# Altium schematic sheet XoomFloppy Pro.SchDoc: XoomFloppy Pro
size 420 x 297 mm; Author: DiWou; CompanyName: DL2DW; DrawnBy: DiWou; Organization: DL2DW; DocumentNumber: 1; Revision: 1.0; SheetNumber: 1; SheetTotal: 1; DrawnDate: 18.11.2019; Title1: XoomFloppy Pro; Title2: .; Title3: .; Desc1: Version 1.0; Desc2: .
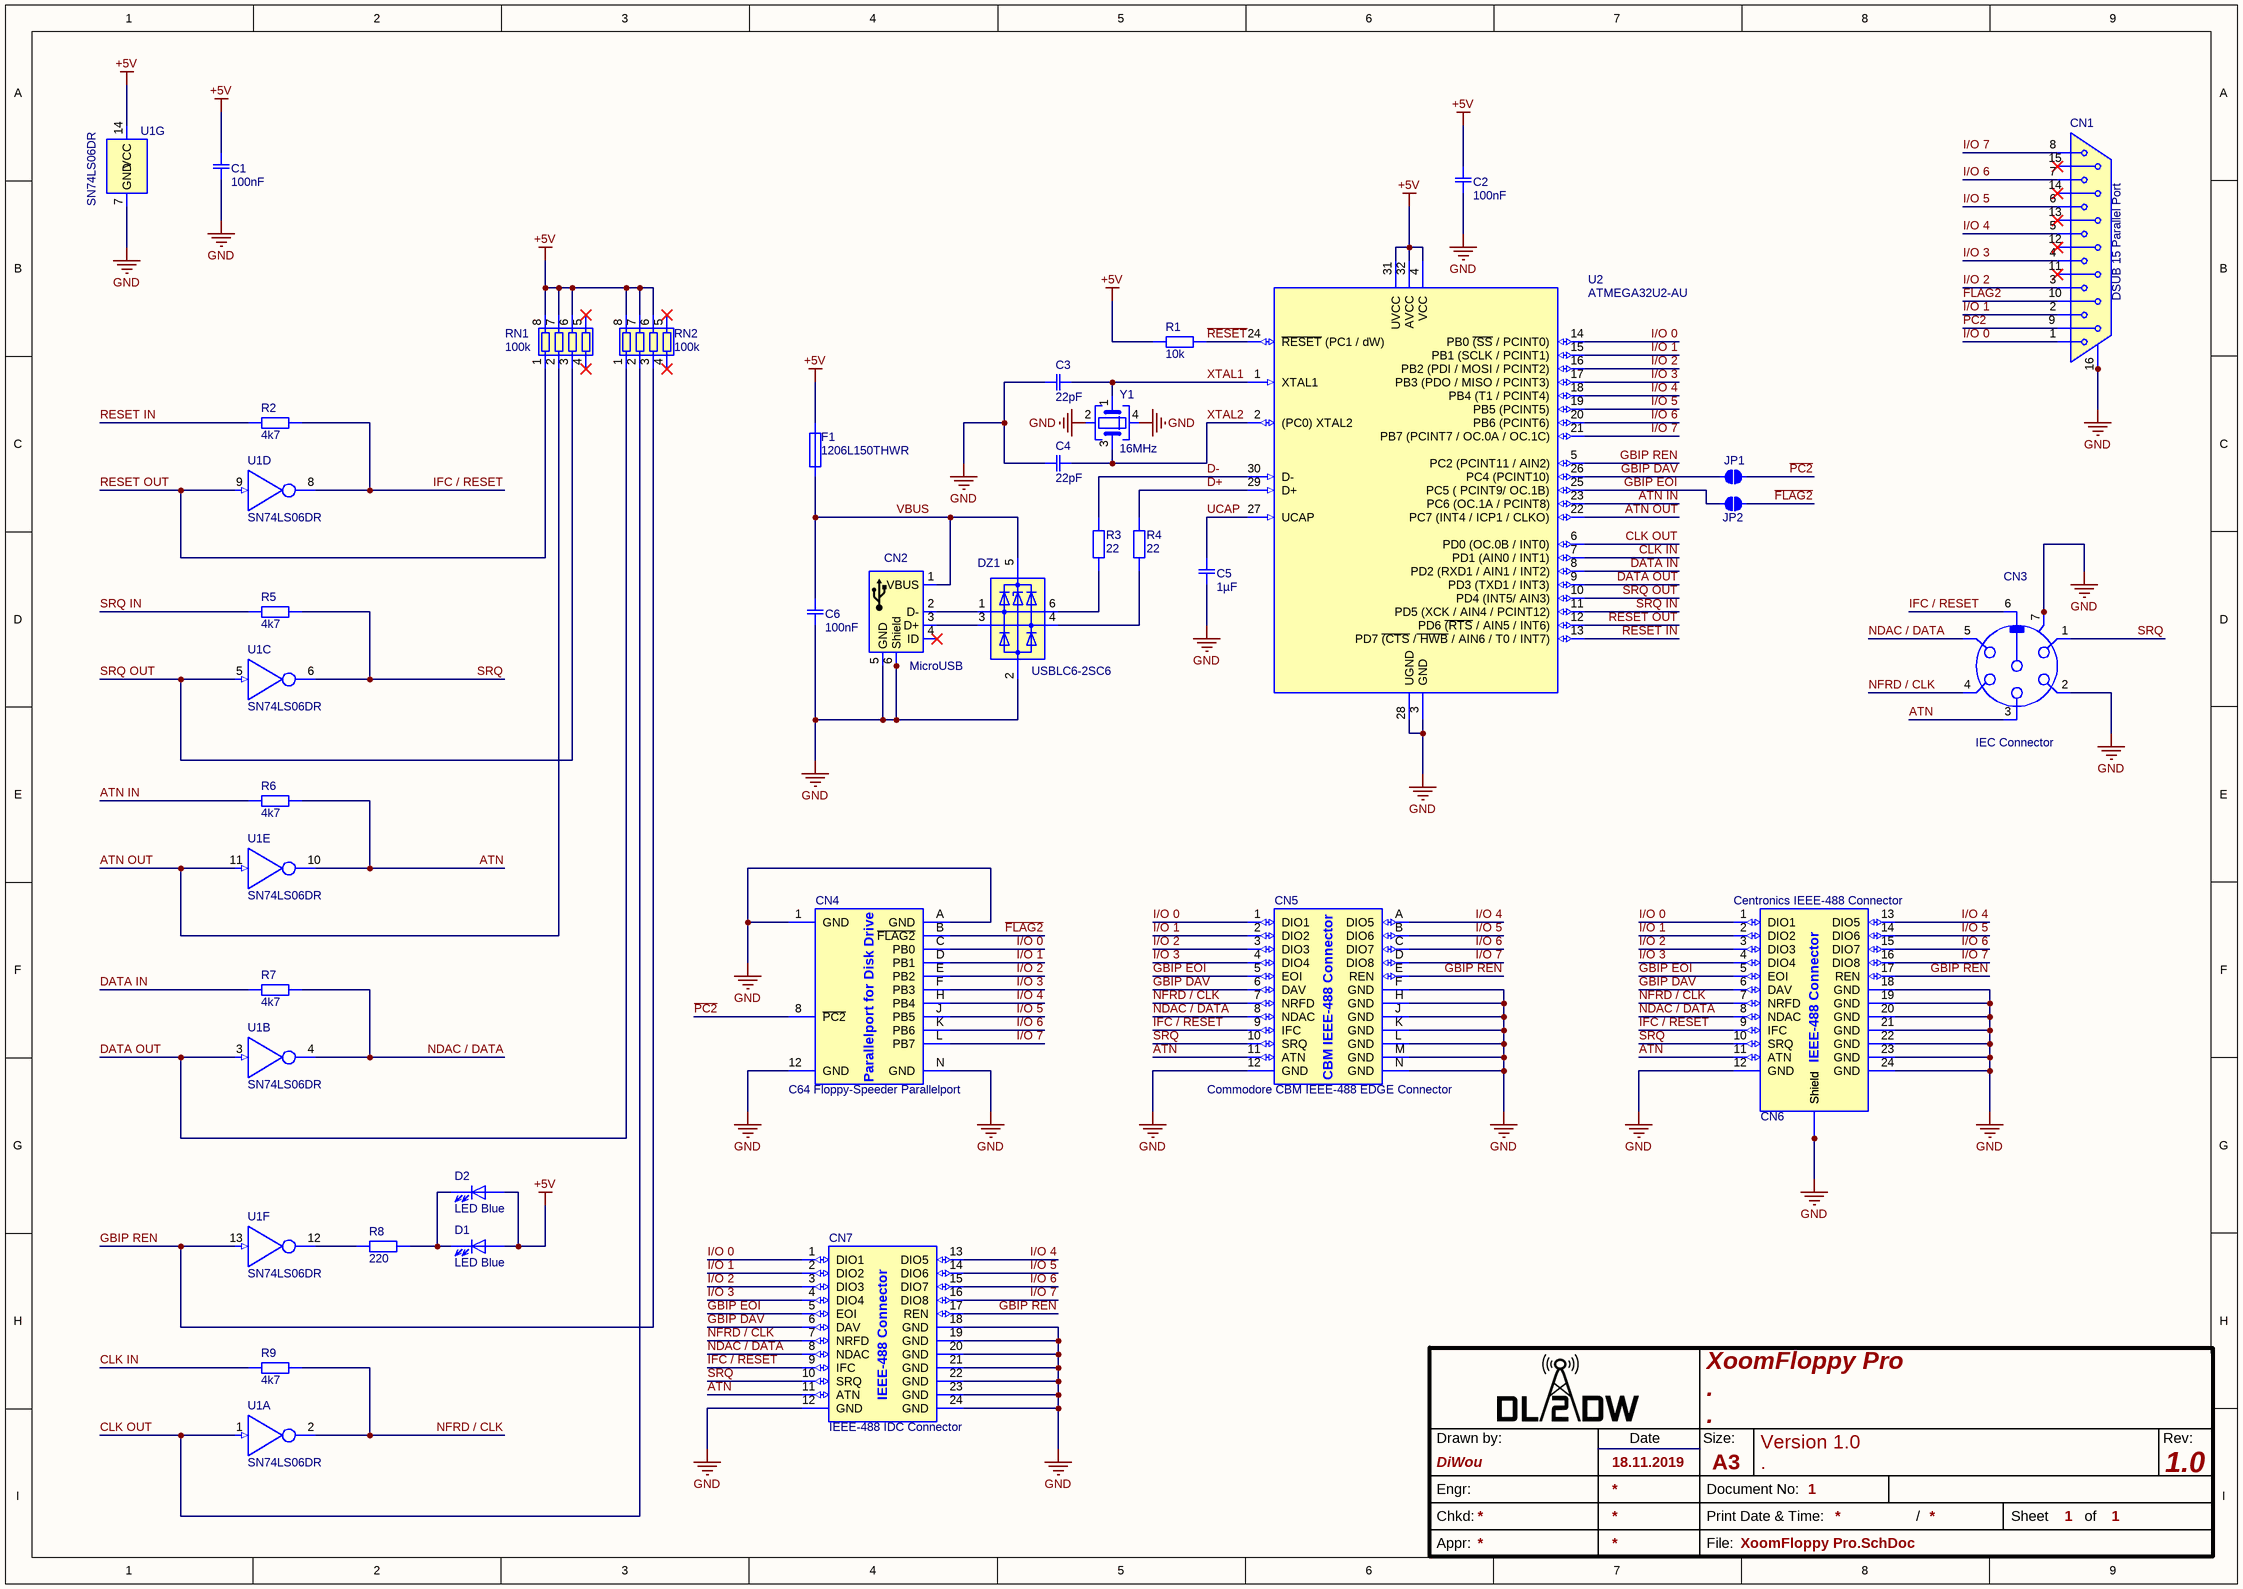
[diagram p0: XoomFloppy Pro.SchDoc]

## Parts
C1  100nF  [CAP 100nF SMD 0603 C0603C104J3RACTU]
C2  100nF  [CAP 100nF SMD 0603 C0603C104J3RACTU]
C3  22pF  [CAP 22pF SMD 0603 C0603C220J5RAC7867]
C4  22pF  [CAP 22pF SMD 0603 C0603C220J5RAC7867]
C5  1µF  [CAP 1µF SMD 0603 C0603C105K3RACTU]
C6  100nF  [CAP 100nF SMD 0603 C0603C104J3RACTU]
CN1  DSUB 15 Parallel Port  [D-SUB 15 Male Connector Right Angle 8.1mm]
CN2  MicroUSB  [MicroUSB Connector Right Angle Receptacle (Würth 629105150521)]
CN3  IEC Connector  [DIN 45322 Circular Connector (DIN-6)]
CN4  C64 Floppy-Speeder Parallelport  [C64 User Port]
CN5  Commodore CBM IEEE-488 EDGE Connector  [CBM IEEE-488 EDGE Connector]
CN6  Centronics IEEE-488 Connector  [GPIB Centronics Female 2x12pos. Connector]
CN7  IEEE-488 IDC Connector  [IEEE-488 IDC Header 2x12 P2.54mm Straight]
D1  LED Blue  [LED Blue SMD 0603]
D2  LED Blue  [LED 3mm Blue Straight]
DZ1  USBLC6-2SC6  [USBLC6-2SC6]
F1  1206L150THWR  [Littelfuse 1206L150THWR]
JP1  Solder Jumper Open  [Solder Jumper Open Variant 2]  (value not drawn)
JP2  Solder Jumper Open  [Solder Jumper Open Variant 2]  (value not drawn)
R1  10k  [10k Ohm R 0603 SMD]
R2  4k7  [4,7k Ohm R 0603 SMD]
R3  22  [22 Ohm R 0603 SMD]
R4  22  [22 Ohm R 0603 SMD]
R5  4k7  [4,7k Ohm R 0603 SMD]
R6  4k7  [4,7k Ohm R 0603 SMD]
R7  4k7  [4,7k Ohm R 0603 SMD]
R8  220  [220 Ohm R 0603 SMD]
R9  4k7  [4,7k Ohm R 0603 SMD]
RN1  100k  [RES ARRAY 4 RES 100K OHM 0804]
RN2  100k  [RES ARRAY 4 RES 100K OHM 0804]
U1  SN74LS06DR  [SN74LS06DR SOIC-14 P1.27mm W3.9mm]  (parts A,B,C,D,E,F,G of 7)
U2  ATMEGA32U2-AU  [TQFP-32 P0.8mm 7x7mm ATMega32u2]
Y1  16MHz  [Crystal 16MHz SMD 2.0x1.6mm 4pos GND2-4]

## Nets
+5V: C1.2 C2.2 D1.2 D2.2 F1.2 R1.1 RN1.6 RN1.7 RN1.8 RN2.6 RN2.7 RN2.8 U1.14(VCC) U2.4(VCC) U2.31(UVCC) U2.32(AVCC)
GND: C1.1 C2.1 C3.1 C4.1 C5.1 C6.1 CN1.16 CN1.17 CN2.5(GND) CN2.6(Shield) CN2.7(Shield) CN2.8(Shield) CN2.9(Shield) CN3.2 CN3.7 CN3.8 CN4.1(GND) CN4.12(GND) CN4.A(GND) CN4.N(GND) CN5.12(GND) CN5.F(GND) CN5.H(GND) CN5.J(GND) CN5.K(GND) CN5.L(GND) CN5.M(GND) CN5.N(GND) CN6.12(GND) CN6.18(GND) CN6.19(GND) CN6.20(GND) CN6.21(GND) CN6.22(GND) CN6.23(GND) CN6.24(GND) CN6.Shield1(Shield) CN6.Shield2(Shield) CN7.12(GND) CN7.18(GND) CN7.19(GND) CN7.20(GND) CN7.21(GND) CN7.22(GND) CN7.23(GND) CN7.24(GND) DZ1.2 U1.7(GND) U2.3(GND) U2.28(UGND) Y1.2 Y1.4
~{FLAG2}: CN1.10 CN4.B(~{FLAG2}) JP2.2
~{PC2}: CN1.9 CN4.8(~{PC2}) JP1.2
~{RESET}: R1.2 U2.24(~{RESET}_(PC1_/_dW))
ATN: CN3.3 CN5.11(ATN) CN6.11(ATN) CN7.11(ATN) R6.2 U1.10(5Y)
ATN IN: R6.1 U2.23(PC6_(OC.1A_/_PCINT8))
ATN OUT: RN1.2 U1.11(5A) U2.22(PC7_(INT4_/_ICP1_/_CLKO))
CLK IN: R9.1 U2.7(PD1_(AIN0_/_INT1))
CLK OUT: RN2.2 U1.1(1A) U2.6(PD0_(OC.0B_/_INT0))
D+: R4.2 U2.29(D+)
D-: R3.2 U2.30(D-)
DATA IN: R7.1 U2.8(PD2_(RXD1_/_AIN1_/_INT2))
DATA OUT: RN2.1 U1.3(2A) U2.9(PD3_(TXD1_/_INT3))
GBIP DAV: CN5.6(DAV) CN6.6(DAV) CN7.6(DAV) JP1.1 U2.26(PC4_(PCINT10))
GBIP EOI: CN5.5(EOI) CN6.5(EOI) CN7.5(EOI) JP2.1 U2.25(PC5_(_PCINT9/_OC.1B))
GBIP REN: CN5.E(REN) CN6.17(REN) CN7.17(REN) RN2.3 U1.13(6A) U2.5(PC2_(PCINT11_/_AIN2))
I/O 0: CN1.1 CN4.C(PB0) CN5.1(DIO1) CN6.1(DIO1) CN7.1(DIO1) U2.14(PB0_~{(SS}_/_PCINT0))
I/O 1: CN1.2 CN4.D(PB1) CN5.2(DIO2) CN6.2(DIO2) CN7.2(DIO2) U2.15(PB1_(SCLK_/_PCINT1))
I/O 2: CN1.3 CN4.E(PB2) CN5.3(DIO3) CN6.3(DIO3) CN7.3(DIO3) U2.16(PB2_(PDI_/_MOSI_/_PCINT2))
I/O 3: CN1.4 CN4.F(PB3) CN5.4(DIO4) CN6.4(DIO4) CN7.4(DIO4) U2.17(PB3_(PDO_/_MISO_/_PCINT3))
I/O 4: CN1.5 CN4.H(PB4) CN5.A(DIO5) CN6.13(DIO5) CN7.13(DIO5) U2.18(PB4_(T1_/_PCINT4))
I/O 5: CN1.6 CN4.J(PB5) CN5.B(DIO6) CN6.14(DIO6) CN7.14(DIO6) U2.19(PB5_(PCINT5))
I/O 6: CN1.7 CN4.K(PB6) CN5.C(DIO7) CN6.15(DIO7) CN7.15(DIO7) U2.20(PB6_(PCINT6))
I/O 7: CN1.8 CN4.L(PB7) CN5.D(DIO8) CN6.16(DIO8) CN7.16(DIO8) U2.21(PB7_(PCINT7_/_OC.0A_/_OC.1C))
IFC / RESET: CN3.6 CN5.9(IFC) CN6.9(IFC) CN7.9(IFC) R2.2 U1.8(4Y)
NDAC / DATA: CN3.5 CN5.8(NDAC) CN6.8(NDAC) CN7.8(NDAC) R7.2 U1.4(2Y)
NFRD / CLK: CN3.4 CN5.7(NRFD) CN6.7(NRFD) CN7.7(NRFD) R9.2 U1.2(1Y)
RESET IN: R2.1 U2.13(PD7_~{(CTS}_/~{_HWB}_/_AIN6_/_T0_/_INT7))
RESET OUT: RN1.1 U1.9(4A) U2.12(PD6_~{(RTS}_/_AIN5_/_INT6))
SRQ: CN3.1 CN5.10(SRQ) CN6.10(SRQ) CN7.10(SRQ) R5.2 U1.6(3Y)
SRQ IN: R5.1 U2.11(PD5_(XCK_/_AIN4_/_PCINT12))
SRQ OUT: RN1.3 U1.5(3A) U2.10(PD4_(INT5/_AIN3))
UCAP: C5.2 U2.27(UCAP)
VBUS: C6.2 CN2.1(VBUS) DZ1.5 F1.1
XTAL1: C3.2 U2.1(XTAL1) Y1.1
XTAL2: C4.2 U2.2((PC0)_XTAL2) Y1.3
NetCN2_2: CN2.2(D-) DZ1.1
NetCN2_3: CN2.3(D+) DZ1.3
NetD1_1: D1.1 D2.1 R8.2
NetDZ1_4: DZ1.4 R4.1
NetDZ1_6: DZ1.6 R3.1
NetR8_1: R8.1 U1.12(6Y)

Not connected (* = marked no-connect by the designer): CN1 11* 12* 13* 14* 15*; CN2 4(ID)* 10(Mounting_Hole) 11(Mounting_Hole); CN4 2(N/C) 3(N/C) 4(N/C) 5(N/C) 6(N/C) 7(N/C) 9(N/C) 10(N/C) 11(N/C) M(N/C); CN6 H1(Hole) H2(Hole); RN1 4* 5*; RN2 4* 5*

## Notes on the sheet
- Drawn by:
- Date
- Size:
- A3
- Rev:
- Engr:
- Chkd:
- Appr:
- File:
- Document No:
- Print Date & Time:
- /
- Sheet
- of
- (in symbol CMP-Commodore-00003-4) CBM IEEE-488 Connector
- (in symbol CMP-Commodore-00005-4) Parallelport for Disk Drive
- (in symbol CMP-Connectors-00013-5) IEEE-488 Connector

## Library data of the parts
C1 C2 C6 = CMP-Capacitors-Ceramic_Capacitors-00012-1: KEMET         C0603C104J3RACTU             SMD Multilayer Ceramic Capacitor, 0603 [1608 Metric], 0.1 F, 25 V,  5%, X7R, C Series; Voltage Rating (DC): 25V; Height: 0.8mm; Dielectric: X7R; Case Code (Metric): 1608; Width: 0.031inch; Depth: 0.8mm; Min Operating Temperature: -55°C; Number of Pins: 2; Mount: Surface Mount,PCB; REACH SVHC: No SVHC; Packaging: Tape and Reel; Case Code (Imperial): 0603; Contact Plating: Tin,Matte; Length: 1.6mm; Case/Package: 0603; Lead Pitch: 0.7mm; Package Quantity: 4000; Tolerance: 5%; Radiation Hardening: No; Dielectric Material: Ceramic; Voltage: 25V; Termination: SMD/SMT; Capacitance: 100nF; Voltage Rating: 25V; Thickness: 0.034inch; Max Operating Temperature: 125°C
C3 C4 = CMP-Capacitors-Ceramic_Capacitors-00013-1: 22.0PF 50.0V; Tolerance: 5%; Dielectric: X7R; Voltage Rating (DC): 50V; Capacitance: 2.2E-11F; Dielectric Material: Ceramic; Case/Package: 0603
C5 = CMP-Capacitors-Ceramic_Capacitors-00014-1: KEMET 1F Multilayer Ceramic Capacitor (MLCC) 25 V 10% X7R dielectric C SMD max op. temp. +125C; Dissipation Factor: 5%; Voltage Rating: 25V; Capacitance: 1uF; Case Code (Imperial): 0603; Termination: SMD/SMT; Thickness: 0.034inch; REACH SVHC: No SVHC; Depth: 0.8mm; Width: 0.031inch; Case Code (Metric): 1608; Min Operating Temperature: -55°C; Dielectric: X7R; Package Quantity: 1; Packaging: Tape and Reel; Height: 0.8mm; Max Operating Temperature: 125°C; Tolerance: 10%; Voltage Rating (DC): 25V; Voltage: 25V; Dielectric Material: Ceramic; Case/Package: 0603; Mount: Surface Mount; Length: 1.6mm
CN1 = CMP-D-SUB_Connectors-00000-6: HARTING         09 64 223 7802             Filtered D Sub Connector, Ferrite, DA, Plug, 15 Contacts, 0 F, Steel Body; Current Rating: 7.5A; Number of Positions: 15; Gender: Male; Pitch: 2.77mm; Capacitance: 0pF; Connector Type: D-Sub,Plug,Signal; Voltage Rating: 250V; Orientation: Right Angle; Min Operating Temperature: -55°C; Contact Plating: Gold; Width: 18.5mm; Termination: Solder; Max Operating Temperature: 105°C; Package Quantity: 70; Length: 39.2mm; Depth: 12.5mm; Number of Contacts: 15; Number of Rows: 2; Housing Material: PBT; Material: Polybutylene; Packaging: Bulk; Mount: Through Hole,Panel; Body Material: Steel; REACH SVHC: No SVHC
CN2 = CMP-Connectors-USB_Connectors-00001-1: Socket micro-USB B 5P, 629105150521, Würth Elektronik; Gender: Receptacle; Number of Contacts: 5; USB Standard: USB 2.0; Connector Type: USB; Orientation: Right Angle; Lead Free: Lead Free; Mount: Surface Mount,Horizontal; REACH SVHC: Unknown; Contact Plating: Gold; Packaging: Tape and Reel; Termination: SMD/SMT; Features: Shielded; Contact Material: Copper Alloy
CN3 = CMP-Connectors-DIN_Connectors00000-3: DIN chassis socket, right angle version, with ground contact, suitable for locking, for printed circuit boards
CN4 = CMP-Commodore-00005-4: EDGE Connector like C64 Userport for "SpeedDOS"
CN5 = CMP-Commodore-00003-4: PCB connector for connecting IEEE-488 devices
CN6 = CMP-Connectors-00013-5: L-COM - CIB24SRA - CONNECTOR GPIB R/A FEMALE
CN7 = CMP-Commodore-00004-4: IEEE-488 IDC Connector Right Angle or Straight
D1 = CMP-LEDs-00001-1: LED BLUE DIFFUSED 0603 SMD; Lens Style: Flat; Lens Size: 0.8mm; Viewing Angle: 140°; Test Current: 20mA; Dominant Wavelength: 470nm; Forward Voltage: 3.2V; Luminous Intensity: 80mcd; Case/Package: 0603; Length: 1.6mm; Lens Transparency: Diffused; Height: 0.5mm; Color: Blue; Mount: Surface Mount; Width: 0.8mm; Packaging: Tape and Reel
D2 = CMP-LEDs-0000-4: WURTH ELEKTRONIK   151033BS03000   LED, 3MM, BLUE, 3800MCD, 470NM; Forward Current: 30mA; Viewing Angle: 30°; Forward Voltage: 2.8V; Lens Style: Clear,Circular,Round; Test Current: 20mA; Wavelength: 470nm; Color: Blue; Package Quantity: 1; Luminous Intensity: 3800mcd; Lens Size: 3mm; Dominant Wavelength: 470nm; Packaging: Bulk; Mount: Through Hole; REACH SVHC: Unknown; Min Operating Temperature: -40°C; Case/Package: Radial; Max Operating Temperature: 85°C; Height: 5.55mm
DZ1 = CMP-Diodes-00005-3: TVS DIODE 5.25V 17V SOT23-6; Working Voltage: 5V; Test Current: 1mA; Direction: Unidirectional,Bidirectional; Leakage Current: 150nA; Capacitance: 3.5pF; Number of Bidirectional Channels: 2; Max Breakdown Voltage: 6V; ESD Protection: Yes; Operating Supply Voltage: 1.1V; Element Configuration: Dual; Peak Pulse Current: 5A; Number of Elements: 1; Data Rate: 480Mbps; Package Quantity: 3000; Max Operating Temperature: 125°C; Width: 1.75mm; Contact Plating: Tin,Matte; Packaging: Tape and Reel; Termination: SMD/SMT; Max Reverse Leakage Current: 150nA; Min Operating Temperature: -40°C; Power Line Protection: Yes; Radiation Hardening: No; REACH SVHC: No SVHC; Breakdown Voltage: 6V; Length: 3.05mm; Clamping Voltage: 17V; Mount: Surface Mount; Depth: 1.75mm; Number of Pins: 6; Reverse Standoff Voltage: 5.25V; Number of Channels: 2; Min Breakdown Voltage: 6V; Height: 1.3mm; Reverse Breakdown Voltage: 6V; Polarity: Unidirectional,Bidirectional; Case/Package: SOT-23; Lead Free: Lead Free
F1 = CMP-Fuses-0001-1: PTC RESET FUSE 8V 1.5A 1206; Time to Trip: 0.3s; Working Voltage: 6V; Current Rating: 100A; Resistance: 120mR; Power Dissipation: 800mW; Approvals: cULus,TUV; Trip Current: 3A; Voltage Rating: 8V; Package Quantity: 3000; Packaging: Tape and Reel; Termination: SMD/SMT; Length: 3.4mm; REACH SVHC: Unknown; Terminal Material: Copper; Voltage Rating (DC): 8V; Max Operating Temperature: 85°C; Min Operating Temperature: -40°C; Lead Free: Lead Free; Case Code (Metric): 3216; Hold Current: 1.5A; Width: 1.8mm; Height: 0.75mm; Operating Supply Voltage: 8V; Max Current Rating: 100A; Max Voltage Rating (DC): 8V; Case Code (Imperial): 1206; Case/Package: 1206
JP1 JP2 = CMP-Mechanicals-00016-12
R1 = CMP-Resistors-Yageo_SMD_0805-0170-1: RES SMD 10K OHM 1% 1/10W 0603; Voltage Rating (DC): 50V; Power Rating: 100mW; Resistance: 10kR; Voltage Rating: 75V; Temperature Coefficient: 100ppm/°C; Length: 1.6mm; Height: 0.45mm; Min Operating Temperature: -55°C; Military Standard: Not; REACH SVHC: No SVHC; Lead Pitch: 0.3mm; Lead Free: Lead Free; Case/Package: 0603; Packaging: Tape and Reel; Number of Pins: 2; Tolerance: 1%; Termination: SMD/SMT; Composition: Thick Film; Width: 0.8mm; Weight: 7.1E-05oz; Case Code (Metric): 1608; Depth: 0.8mm; Max Operating Temperature: 155°C; Case Code (Imperial): 0603
R2 R5-R7 R9 = CMP-Resistors-Yageo_SMD_0805-0169-1: RES SMD 4.7K OHM 1% 1/10W 0603; Resistance: 4.7kR; Voltage Rating: 50V; Temperature Coefficient: 100ppm/°C; Power Rating: 100mW; Military Standard: Not; Packaging: Tape and Reel; Tolerance: 1%; Case Code (Imperial): 0603; Composition: Thick Film; Min Operating Temperature: -55°C; Width: 0.8mm; Length: 1.6mm; Termination: SMD/SMT; Case/Package: 0603; Lead Pitch: 0.3mm; Lead Free: Lead Free; Max Operating Temperature: 155°C; Voltage Rating (DC): 50V; REACH SVHC: No SVHC; Case Code (Metric): 1608; Depth: 0.8mm; Number of Pins: 2; Height: 0.45mm
R3 R4 = CMP-Resistors-Yageo_SMD_0805-0172-1: RES SMD 22 OHM 1% 1/10W 0603; Temperature Coefficient: 100ppm/°C; Resistance: 22R; Max Power Dissipation: 100mW; Voltage Rating: 50V; Width: 0.031inch; Termination: SMD/SMT; REACH SVHC: No SVHC; Number of Terminations: 2; Case/Package: 0603; Composition: Thick Film; Lead Free: Lead Free; Case Code (Metric): 1608; Features: Moisture Resistant; Packaging: Tape and Reel; Length: 1.6mm; Military Standard: Not; Height: 0.022inch; Case Code (Imperial): 0603; Max Operating Temperature: 155°C; Depth: 0.8mm; Min Operating Temperature: -55°C; Package Quantity: 1; Power Rating: 100mW; Tolerance: 1%; Number of Pins: 2; Voltage Rating (DC): 50V
R8 = CMP-Resistors-Yageo_SMD_0805-0171-1: RES SMD 220 OHM 1% 1/10W 0603; Resistance: 220R; Voltage Rating: 50V; Temperature Coefficient: 100ppm/°C; Power Rating: 100mW; Number of Pins: 2; Width: 0.031inch; Case Code (Imperial): 0603; Case Code (Metric): 1608; Max Operating Temperature: 155°C; Length: 1.6mm; Composition: Thick Film; Package Quantity: 1; Tolerance: 1%; Height: 0.022inch; REACH SVHC: No SVHC; Lead Free: Lead Free; Features: Moisture Resistant; Number of Terminations: 2; Voltage Rating (DC): 50V; Depth: 0.8mm; Case/Package: 0603; Military Standard: Not; Termination: SMD/SMT; Max Power Dissipation: 100mW; Packaging: Tape and Reel; Min Operating Temperature: -55°C
RN1 RN2 = CMP-Resistors-00011-2: RES ARRAY 4 RES 100K OHM 0804; Circuit Type: Isolated; Number of Circuits: 4; Power Per Element: 62.5mW; Resistance: 100kR; Tolerance: 1%; Temperature Coefficient: 200ppm/°C; Packaging: Tape and Reel; Length: 0.079inch; Width: 0.039inch; Mount: Surface Mount; Number of Resistors: 4; Number of Pins: 8; Case/Package: 0804; Min Operating Temperature: -55°C; Height: 0.02inch; Max Operating Temperature: 125°C
U1 = CMP-ICs-74xx-series-00051-2: IC INVERTER OPEN COL 6CH 14SOIC; Propagation Delay: 20ns; High Level Output Current: -250uA; Logic Function: Buffer,Inverter; Polarity: Inverting; Max Supply Voltage: 5.25V; Number of Inputs: 6; Operating Supply Voltage: 5V; Min Supply Voltage: 4.75V; Low Level Output Current: 40mA; Lead Free: Lead Free; Radiation Hardening: No; Package Quantity: 1; Max Operating Temperature: 70°C; REACH SVHC: No SVHC; Turn-On Delay Time: 20ns; Mount: Surface Mount; Number of Pins: 14; Number of Elements: 6; Packaging: Tape and Reel; Number of Outputs: 6; Number of Bits: 6; Number of Input Lines: 6; Min Operating Temperature: 0°C; Number of Channels: 6; Case/Package: SOIC; Number of Gates: 6; Contact Plating: Gold; Number of Circuits: 6; Number of Output Lines: 6
U2 = CMP-ICs-00001-3: ATMEL         ATMEGA32U2-AU            MCU, 8BIT, MEGAAVR, 16MHZ, TQFP-32; Core Architecture: AVR; Max Supply Voltage: 5.5V; Peripherals: Brown-out Detect/Reset,POR,PWM,WDT; Density: 32KB; Oscillator Type: Internal; Min Supply Voltage: 2.7V; Number of PWM Channels: 5; Number of Timers/Counters: 2; Memory Type: FLASH; Number of SPI Channels: 1; Watchdog Timer: Yes; Data Bus Width: 8b; Interface: SPI,USB,UART,USART; Number of I/Os: 22; RAM Size: 1KB; Frequency: 16MHz; Height: 1.05mm; Termination: SMD/SMT; Max Frequency: 16MHz; Number of Pins: 32; Packaging: Tray; Lead Free: Lead Free; Max Operating Temperature: 85°C; REACH SVHC: No SVHC; Memory Size: 32KB; Mount: Surface Mount; Radiation Hardening: No; Contact Plating: Tin,Matte; Package Quantity: 1250; Width: 7mm; Number of Programmable I/O: 22; Length: 7mm; Min Operating Temperature: -40°C; Case/Package: A
Y1 = CMP-Crystals_Oscilators-00001-1: 16MHz ±10ppm 9pF 200Ω SMD,2.0x1.6mm SMD Crystal Resonators RoHS